# EAGLE schematic EEZ DIB MCU r1B1 (EAGLE 9.1.0)
Assembly variants: Farnell, TME

## Sheet 1 of 5: I/O connectors, encoders, user SW
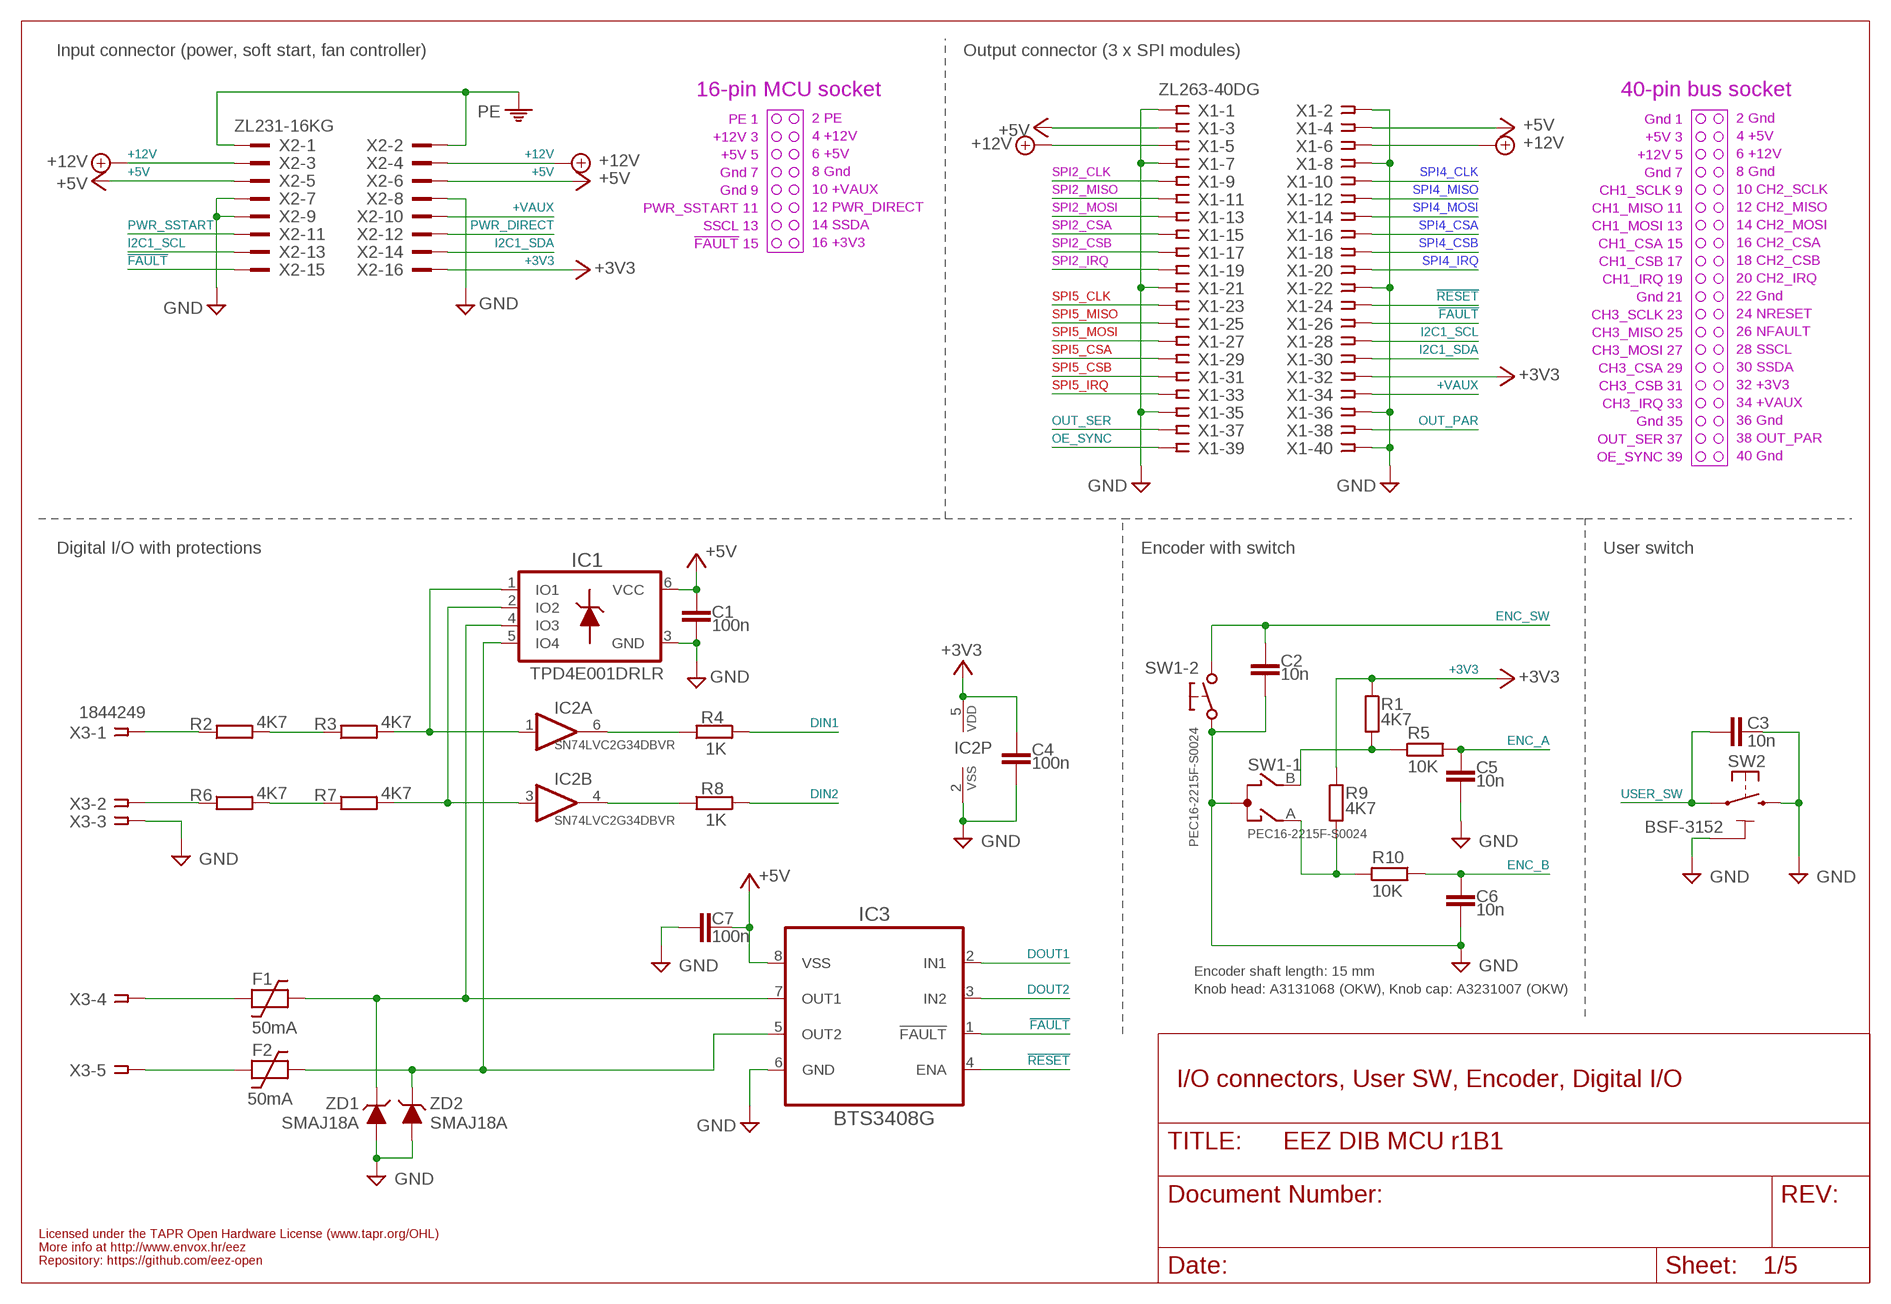
[diagram p0: schematic, sheet 1]

### Parts
C1  100n  C-EUC0603  [C0603]
C2  10n  C-EUC0805  [C0805]
C3  10n  C-EUC0805  [C0805]
C4  100n  C-EUC0603  [C0603]
C5  10n  C-EUC0805  [C0805]
C6  10n  C-EUC0805  [C0805]
C7  100n  C-EUC0603  [C0603]
F1  50mA  FUSE_RESETTABLE21210  [F1210]
F2  50mA  FUSE_RESETTABLE21210  [F1210]
IC1  TPD4E001DRLR  TPD4E001-DRL  [DRL6]
IC2  SN74LVC2G34DBVR  [DBV6]
IC3  BTS3408G  [SOIC127P600X173-8N]
R1  4K7  R-EU_R0805  [R0805]
R2  4K7  R-EU_R0805  [R0805]
R3  4K7  R-EU_R0805  [R0805]
R4  1K  R-EU_R0805  [R0805]
R5  10K  R-EU_R0805  [R0805]
R6  4K7  R-EU_R0805  [R0805]
R7  4K7  R-EU_R0805  [R0805]
R8  1K  R-EU_R0805  [R0805]
R9  4K7  R-EU_R0805  [R0805]
R10  10K  R-EU_R0805  [R0805]
SW1  PEC16-2215F-S0024  ENCODER_SW-PEC16  [PEC16-2215F]
SW2  BSF-3152  BSF-315X  [BSF-315X]
X1  ZL263-40DG  [ZL263-40DG]
X2  ZL231-16KG  IDC-16PIN-ANGLED  [ML16L]
X3  1844249  MC1,5/5-G-3,5  [MC1,5/5-G-3,5]
ZD1  SMAJ18A  PSMAXX  [DO214AC]
ZD2  SMAJ18A  PSMAXX  [DO214AC]

### Nets
!FAULT: IC3.1(!FAULT) X1.26 X2.15 ; also sheet 2
!RESET: IC3.4(ENA) X1.24 ; also sheet 2,3,4,5
+3V3: C4.1 IC2.5(P:VDD) R1.1 R9.1 X1.32 X2.16 ; also sheet 2,3,4,5
+5V: C1.1 C7.2 IC1.6(VCC) IC3.8(VSS) X1.3 X1.4 X2.5 X2.6 ; also sheet 2,4
+12V: X1.5 X1.6 X2.3 X2.4
+VAUX: X1.34 X2.10
DIN1: R4.2 ; also sheet 2
DIN2: R8.2 ; also sheet 2
DOUT1: IC3.2(IN1) ; also sheet 2
DOUT2: IC3.3(IN2) ; also sheet 2
ENC_A: C5.2 R5.1 ; also sheet 2
ENC_B: C6.1 R10.1 ; also sheet 2
ENC_SW: C2.2 SW1.E ; also sheet 2
EOUT_A: R9.2 R10.2 SW1.A(-1:A)
EOUT_B: R1.2 R5.2 SW1.B(-1:B)
GND [gnd]: C1.2 C2.1 C3.1 C4.2 C5.1 C6.2 C7.1 IC1.3(GND) IC2.2(P:VSS) IC3.6(GND) SW1.C(-1:C) SW1.D SW1.GND1(-1:C) SW1.GND2(-1:C) SW2.2 SW2.3(GND) SW2.4(GND) X1.1 X1.2 X1.7 X1.8 X1.21 X1.22 X1.35 X1.36 X1.40 X2.7 X2.8 X2.9 X3.3 ZD1.A ZD2.A ; also sheet 2,3,4,5
I2C1_SCL: X1.28 X2.13 ; also sheet 2,3,4
I2C1_SDA: X1.30 X2.14 ; also sheet 2,3,4
N$38: R2.2 R3.1
N$39: R2.1 X3.1
N$40: R6.1 X3.2
N$41: R6.2 R7.1
N$42: IC2.6(A:O) R4.1
N$43: IC2.4(B:O) R8.1
N$44: F1.1 X3.4
N$45: F2.1 X3.5
N$46: IC1.1(IO1) IC2.1(A:I) R3.2
N$47: IC1.2(IO2) IC2.3(B:I) R7.2
N$48: F1.2 IC1.4(IO3) IC3.7(OUT1) ZD1.C
N$49: F2.2 IC1.5(IO4) IC3.5(OUT2) ZD2.C
OE_SYNC: X1.39 ; also sheet 2
OUT_PAR: X1.38 ; also sheet 2
OUT_SER: X1.37 ; also sheet 2
PE: X2.1 X2.2 ; also sheet 4,5
PWR_DIRECT: X2.12 ; also sheet 2
PWR_SSTART: X2.11 ; also sheet 2
SPI2_CLK: X1.9 ; also sheet 2
SPI2_CSA: X1.15 ; also sheet 2
SPI2_CSB: X1.17 ; also sheet 2
SPI2_IRQ: X1.19 ; also sheet 2
SPI2_MISO: X1.11 ; also sheet 2
SPI2_MOSI: X1.13 ; also sheet 2
SPI4_CLK: X1.10 ; also sheet 2
SPI4_CSA: X1.16 ; also sheet 2
SPI4_CSB: X1.18 ; also sheet 2
SPI4_IRQ: X1.20 ; also sheet 2
SPI4_MISO: X1.12 ; also sheet 2
SPI4_MOSI: X1.14 ; also sheet 2
SPI5_CLK: X1.23 ; also sheet 2
SPI5_CSA: X1.29 ; also sheet 2
SPI5_CSB: X1.31 ; also sheet 2
SPI5_IRQ: X1.33 ; also sheet 2,5
SPI5_MISO: X1.25 ; also sheet 2
SPI5_MOSI: X1.27 ; also sheet 2
USER_SW: C3.2 SW2.1 ; also sheet 2

### Notes on the sheet
- Input connector (power, soft start, fan controller) | Output connector (3 x SPI modules)
- 16-pin MCU socket | 40-pin bus socket
- PE 1 | Gnd 1
- 2 PE | 2 Gnd
- +12V 3 | +5V 3
- 4 +12V | 4 +5V
- +5V 5 | +12V 5
- 6 +5V | 6 +12V
- Gnd 7 | Gnd 7
- 8 Gnd | 8 Gnd
- Gnd 9 | CH1_SCLK 9
- 10 +VAUX | 10 CH2_SCLK
- PWR_SSTART 11 | CH1_MISO 11
- 12 PWR_DIRECT | 12 CH2_MISO
- SSCL 13 | CH1_MOSI 13
- 14 SSDA | 14 CH2_MOSI
- !FAULT! 15 | CH1_CSA 15
- 16 +3V3 | 16 CH2_CSA
- CH1_CSB 17
- 18 CH2_CSB
- CH1_IRQ 19
- 20 CH2_IRQ
- Gnd 21
- 22 Gnd
- CH3_SCLK 23
- 24 NRESET
- CH3_MISO 25
- 26 NFAULT
- CH3_MOSI 27
- 28 SSCL
- CH3_CSA 29
- 30 SSDA
- CH3_CSB 31
- 32 +3V3
- CH3_IRQ 33
- 34 +VAUX
- Gnd 35
- 36 Gnd
- OUT_SER 37
- 38 OUT_PAR
- OE_SYNC 39
- 40 Gnd
- Digital I/O with protections | Encoder with switch | User switch
- Encoder shaft length: 15 mm
- Knob head: A3131068 (OKW), Knob cap: A3231007 (OKW)
- I/O connectors, User SW, Encoder, Digital I/O
- Licensed under the TAPR Open Hardware License (www.tapr.org/OHL)
- More info at http://www.envox.hr/eez
- Repository: https://github.com/eez-open

## Sheet 2 of 5: STM32F7 MCU
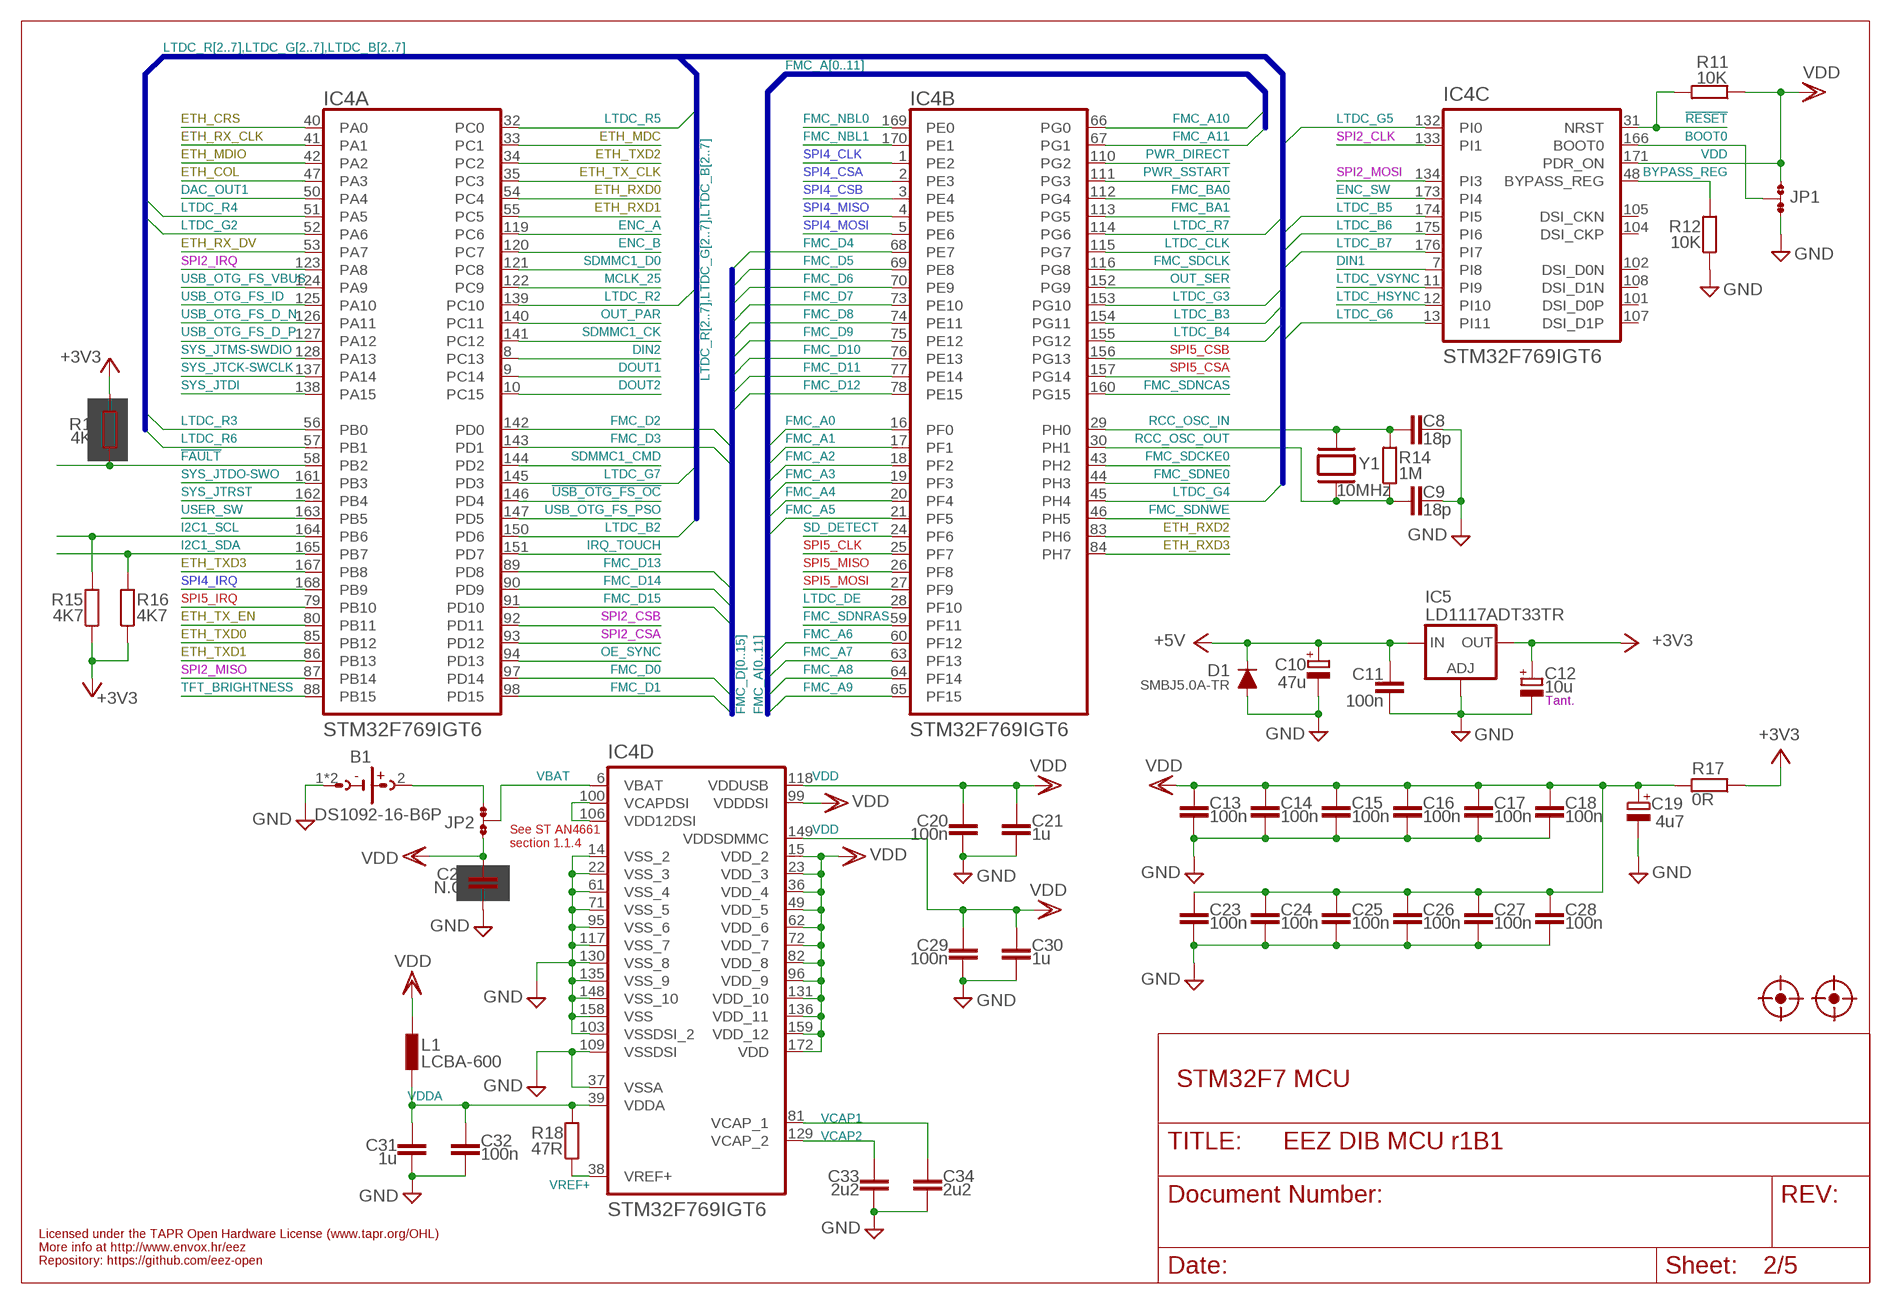
[diagram p1: schematic, sheet 2]

### Parts
B1  DS1092-16-B6P  CELL_BATTERY-THT20MM  [DS1092-16-B6P]
C8  18p  C-EUC0603  [C0603]
C9  18p  C-EUC0603  [C0603]
C10  47u  ECAPPANASONIC_H  [CAPAE660X610N]
C11  100n  C-EUC0603  [C0603]
C12  10u  ECAP1206  [EC1206]
C13  100n  C-EUC0603  [C0603]
C14  100n  C-EUC0603  [C0603]
C15  100n  C-EUC0603  [C0603]
C16  100n  C-EUC0603  [C0603]
C17  100n  C-EUC0603  [C0603]
C18  100n  C-EUC0603  [C0603]
C19  4u7  ECAP1206  [EC1206]
C20  100n  C-EUC0603  [C0603]
C21  1u  C-EUC0805  [C0805]
C22  N.C.  C-EUC0603  [C0603]
C23  100n  C-EUC0603  [C0603]
C24  100n  C-EUC0603  [C0603]
C25  100n  C-EUC0603  [C0603]
C26  100n  C-EUC0603  [C0603]
C27  100n  C-EUC0603  [C0603]
C28  100n  C-EUC0603  [C0603]
C29  100n  C-EUC0603  [C0603]
C30  1u  C-EUC0805  [C0805]
C31  1u  C-EUC0805  [C0805]
C32  100n  C-EUC0603  [C0603]
C33  2u2  C-EUC0805  [C0805]
C34  2u2  C-EUC0805  [C0805]
D1  SMBJ5.0A-TR  DIODEDO214AA  [DO214AA]
FM1  FIDUCIAL  [FIDUCIAL]
FM2  FIDUCIAL  [FIDUCIAL]
IC4  STM32F769IGT6  STM32F769IXT  [LQFP-176_24X24MM]
IC5  LD1117ADT33TR  LD117ADT33TR  [DPACK]
JP1  JP3-CUT  [JP3-CUT]
JP2  JP3-CUT  [JP3-CUT]
L1  LCBA-600  FERRITE_BEAD0603  [BEAD0603]
R11  10K  R-EU_R0805  [R0805]
R12  10K  R-EU_R0805  [R0805]
R13  4K7  R-EU_R0805  [R0805]
R14  1M  R-EU_R0805  [R0805]
R15  4K7  R-EU_R0805  [R0805]
R16  4K7  R-EU_R0805  [R0805]
R17  0R  R-EU_R0805  [R0805]
R18  47R  R-EU_R0805  [R0805]
Y1  10MHz  XTALSMD  [HC-49/4H]

### Nets
!FAULT: IC4.58(A:PB2) R13.2 ; also sheet 1
!RESET: IC4.31(C:NRST) R11.2 ; also sheet 1,3,4,5
!USB_OTG_FS_OC: IC4.146(A:PD4) ; also sheet 4
+3V3: C12.+ IC5.4(OUT) R13.1 R15.1 R16.1 R17.1 ; also sheet 1,3,4,5
+5V: C10.1(+) C11.1 D1.C IC5.3(IN) ; also sheet 1,4
BOOT0: IC4.166(C:BOOT0) JP1.COM
BYPASS_REG: IC4.48(C:BYPASS_REG) R12.2
DAC_OUT1: IC4.50(A:PA4) ; also sheet 4
DIN1: IC4.7(C:PI8) ; also sheet 1
DIN2: IC4.8(A:PC13) ; also sheet 1
DOUT1: IC4.9(A:PC14) ; also sheet 1
DOUT2: IC4.10(A:PC15) ; also sheet 1
ENC_A: IC4.119(A:PC6) ; also sheet 1
ENC_B: IC4.120(A:PC7) ; also sheet 1
ENC_SW: IC4.173(C:PI4) ; also sheet 1
ETH_COL: IC4.47(A:PA3) ; also sheet 5
ETH_CRS: IC4.40(A:PA0) ; also sheet 5
ETH_MDC: IC4.33(A:PC1) ; also sheet 5
ETH_MDIO: IC4.42(A:PA2) ; also sheet 5
ETH_RX_CLK: IC4.41(A:PA1) ; also sheet 5
ETH_RX_DV: IC4.53(A:PA7) ; also sheet 5
ETH_RXD0: IC4.54(A:PC4) ; also sheet 5
ETH_RXD1: IC4.55(A:PC5) ; also sheet 5
ETH_RXD2: IC4.83(B:PH6) ; also sheet 5
ETH_RXD3: IC4.84(B:PH7) ; also sheet 5
ETH_TX_CLK: IC4.35(A:PC3) ; also sheet 5
ETH_TX_EN: IC4.80(A:PB11) ; also sheet 5
ETH_TXD0: IC4.85(A:PB12) ; also sheet 5
ETH_TXD1: IC4.86(A:PB13) ; also sheet 5
ETH_TXD2: IC4.34(A:PC2) ; also sheet 5
ETH_TXD3: IC4.167(A:PB8) ; also sheet 5
FMC_A0: IC4.16(B:PF0) ; also sheet 3
FMC_A1: IC4.17(B:PF1) ; also sheet 3
FMC_A2: IC4.18(B:PF2) ; also sheet 3
FMC_A3: IC4.19(B:PF3) ; also sheet 3
FMC_A4: IC4.20(B:PF4) ; also sheet 3
FMC_A5: IC4.21(B:PF5) ; also sheet 3
FMC_A6: IC4.60(B:PF12) ; also sheet 3
FMC_A7: IC4.63(B:PF13) ; also sheet 3
FMC_A8: IC4.64(B:PF14) ; also sheet 3
FMC_A9: IC4.65(B:PF15) ; also sheet 3
FMC_A10: IC4.66(B:PG0) ; also sheet 3
FMC_A11: IC4.67(B:PG1) ; also sheet 3
FMC_BA0: IC4.112(B:PG4) ; also sheet 3
FMC_BA1: IC4.113(B:PG5) ; also sheet 3
FMC_D0: IC4.97(A:PD14) ; also sheet 3
FMC_D1: IC4.98(A:PD15) ; also sheet 3
FMC_D2: IC4.142(A:PD0) ; also sheet 3
FMC_D3: IC4.143(A:PD1) ; also sheet 3
FMC_D4: IC4.68(B:PE7) ; also sheet 3
FMC_D5: IC4.69(B:PE8) ; also sheet 3
FMC_D6: IC4.70(B:PE9) ; also sheet 3
FMC_D7: IC4.73(B:PE10) ; also sheet 3
FMC_D8: IC4.74(B:PE11) ; also sheet 3
FMC_D9: IC4.75(B:PE12) ; also sheet 3
FMC_D10: IC4.76(B:PE13) ; also sheet 3
FMC_D11: IC4.77(B:PE14) ; also sheet 3
FMC_D12: IC4.78(B:PE15) ; also sheet 3
FMC_D13: IC4.89(A:PD8) ; also sheet 3
FMC_D14: IC4.90(A:PD9) ; also sheet 3
FMC_D15: IC4.91(A:PD10) ; also sheet 3
FMC_NBL0: IC4.169(B:PE0) ; also sheet 3
FMC_NBL1: IC4.170(B:PE1) ; also sheet 3
FMC_SDCKE0: IC4.43(B:PH2) ; also sheet 3
FMC_SDCLK: IC4.116(B:PG8) ; also sheet 3
FMC_SDNCAS: IC4.160(B:PG15) ; also sheet 3
FMC_SDNE0: IC4.44(B:PH3) ; also sheet 3
FMC_SDNRAS: IC4.59(B:PF11) ; also sheet 3
FMC_SDNWE: IC4.46(B:PH5) ; also sheet 3
GND [gnd]: B1.1(-) B1.3(-) C8.1 C9.1 C10.2(-) C11.2 C12.- C13.2 C14.2 C15.2 C16.2 C17.2 C18.2 C19.- C20.2 C21.2 C22.2 C23.2 C24.2 C25.2 C26.2 C27.2 C28.2 C29.2 C30.2 C31.2 C32.2 C33.2 C34.2 D1.A IC4.14(D:VSS_2) IC4.22(D:VSS_3) IC4.37(D:VSSA) IC4.61(D:VSS_4) IC4.71(D:VSS_5) IC4.95(D:VSS_6) IC4.103(D:VSSDSI_2) IC4.109(D:VSSDSI) IC4.117(D:VSS_7) IC4.130(D:VSS_8) IC4.135(D:VSS_9) IC4.148(D:VSS_10) IC4.158(D:VSS) IC5.1(ADJ) JP1.NC R12.1 ; also sheet 1,3,4,5
I2C1_SCL: IC4.164(A:PB6) R15.2 ; also sheet 1,3,4
I2C1_SDA: IC4.165(A:PB7) R16.2 ; also sheet 1,3,4
IRQ_TOUCH: IC4.151(A:PD7) ; also sheet 4
LTDC_B2: IC4.150(A:PD6) ; also sheet 4
LTDC_B3: IC4.154(B:PG11) ; also sheet 4
LTDC_B4: IC4.155(B:PG12) ; also sheet 4
LTDC_B5: IC4.174(C:PI5) ; also sheet 4
LTDC_B6: IC4.175(C:PI6) ; also sheet 4
LTDC_B7: IC4.176(C:PI7) ; also sheet 4
LTDC_CLK: IC4.115(B:PG7) ; also sheet 4
LTDC_DE: IC4.28(B:PF10) ; also sheet 4
LTDC_G2: IC4.52(A:PA6) ; also sheet 4
LTDC_G3: IC4.153(B:PG10) ; also sheet 4
LTDC_G4: IC4.45(B:PH4) ; also sheet 4
LTDC_G5: IC4.132(C:PI0) ; also sheet 4
LTDC_G6: IC4.13(C:PI11) ; also sheet 4
LTDC_G7: IC4.145(A:PD3) ; also sheet 4
LTDC_HSYNC: IC4.12(C:PI10) ; also sheet 4
LTDC_R2: IC4.139(A:PC10) ; also sheet 4
LTDC_R3: IC4.56(A:PB0) ; also sheet 4
LTDC_R4: IC4.51(A:PA5) ; also sheet 4
LTDC_R5: IC4.32(A:PC0) ; also sheet 4
LTDC_R6: IC4.57(A:PB1) ; also sheet 4
LTDC_R7: IC4.114(B:PG6) ; also sheet 4
LTDC_VSYNC: IC4.11(C:PI9) ; also sheet 4
MCLK_25: IC4.122(A:PC9) ; also sheet 5
N$20: B1.2(+) JP2.NC
N$178: IC4.100(D:VCAPDSI) IC4.106(D:VDD12DSI)
OE_SYNC: IC4.94(A:PD13) ; also sheet 1
OUT_PAR: IC4.140(A:PC11) ; also sheet 1
OUT_SER: IC4.152(B:PG9) ; also sheet 1
PWR_DIRECT: IC4.110(B:PG2) ; also sheet 1
PWR_SSTART: IC4.111(B:PG3) ; also sheet 1
RCC_OSC_IN: C8.2 IC4.29(B:PH0) R14.2 Y1.2
RCC_OSC_OUT: C9.2 IC4.30(B:PH1) R14.1 Y1.1
SD_DETECT: IC4.24(B:PF6) ; also sheet 3
SDMMC1_CK: IC4.141(A:PC12) ; also sheet 3
SDMMC1_CMD: IC4.144(A:PD2) ; also sheet 3
SDMMC1_D0: IC4.121(A:PC8) ; also sheet 3
SPI2_CLK: IC4.133(C:PI1) ; also sheet 1
SPI2_CSA: IC4.93(A:PD12) ; also sheet 1
SPI2_CSB: IC4.92(A:PD11) ; also sheet 1
SPI2_IRQ: IC4.123(A:PA8) ; also sheet 1
SPI2_MISO: IC4.87(A:PB14) ; also sheet 1
SPI2_MOSI: IC4.134(C:PI3) ; also sheet 1
SPI4_CLK: IC4.1(B:PE2) ; also sheet 1
SPI4_CSA: IC4.2(B:PE3) ; also sheet 1
SPI4_CSB: IC4.3(B:PE4) ; also sheet 1
SPI4_IRQ: IC4.168(A:PB9) ; also sheet 1
SPI4_MISO: IC4.4(B:PE5) ; also sheet 1
SPI4_MOSI: IC4.5(B:PE6) ; also sheet 1
SPI5_CLK: IC4.25(B:PF7) ; also sheet 1
SPI5_CSA: IC4.157(B:PG14) ; also sheet 1
SPI5_CSB: IC4.156(B:PG13) ; also sheet 1
SPI5_IRQ: IC4.79(A:PB10) ; also sheet 1,5
SPI5_MISO: IC4.26(B:PF8) ; also sheet 1
SPI5_MOSI: IC4.27(B:PF9) ; also sheet 1
SYS_JTCK-SWCLK: IC4.137(A:PA14) ; also sheet 3
SYS_JTDI: IC4.138(A:PA15) ; also sheet 3
SYS_JTDO-SWO: IC4.161(A:PB3) ; also sheet 3
SYS_JTMS-SWDIO: IC4.128(A:PA13) ; also sheet 3
SYS_JTRST: IC4.162(A:PB4) ; also sheet 3
TFT_BRIGHTNESS: IC4.88(A:PB15) ; also sheet 4
USB_OTG_FS_D_N [diff]: IC4.126(A:PA11) ; also sheet 4
USB_OTG_FS_D_P [diff]: IC4.127(A:PA12) ; also sheet 4
USB_OTG_FS_ID: IC4.125(A:PA10) ; also sheet 4
USB_OTG_FS_PSO: IC4.147(A:PD5) ; also sheet 4
USB_OTG_FS_VBUS: IC4.124(A:PA9) ; also sheet 4
USER_SW: IC4.163(A:PB5) ; also sheet 1
VBAT: IC4.6(D:VBAT) JP2.COM
VCAP1: C34.1 IC4.81(D:VCAP_1)
VCAP2: C33.1 IC4.129(D:VCAP_2)
VDD: C13.1 C14.1 C15.1 C16.1 C17.1 C18.1 C19.+ C20.1 C21.1 C22.1 C23.1 C24.1 C25.1 C26.1 C27.1 C28.1 C29.1 C30.1 IC4.15(D:VDD_2) IC4.23(D:VDD_3) IC4.36(D:VDD_4) IC4.49(D:VDD_5) IC4.62(D:VDD_6) IC4.72(D:VDD_7) IC4.82(D:VDD_8) IC4.96(D:VDD_9) IC4.99(D:VDDDSI) IC4.118(D:VDDUSB) IC4.131(D:VDD_10) IC4.136(D:VDD_11) IC4.149(D:VDDSDMMC) IC4.159(D:VDD_12) IC4.171(C:PDR_ON) IC4.172(D:VDD) JP1.NO JP2.NO L1.P$1 R11.1 R17.2
VDDA: C31.1 C32.1 IC4.39(D:VDDA) L1.P$2 R18.2
VREF+: IC4.38(D:VREF+) R18.1
Unconnected: IC4.101(C:DSI_D0P) IC4.102(C:DSI_D0N) IC4.104(C:DSI_CKP) IC4.105(C:DSI_CKN) IC4.107(C:DSI_D1P) IC4.108(C:DSI_D1N)

### Buses
FMC_A[0..11]
LTDC_R[2..7],LTDC_G[2..7],LTDC_B[2..7]
FMC_D[0..15]

### Notes on the sheet
- Tant.
- See ST AN4661
  section 1.1.4
- STM32F7 MCU
- Licensed under the TAPR Open Hardware License (www.tapr.org/OHL)
- More info at http://www.envox.hr/eez
- Repository: https://github.com/eez-open

## Sheet 3 of 5: SDRAM, JTAG, SD card, EEPROM
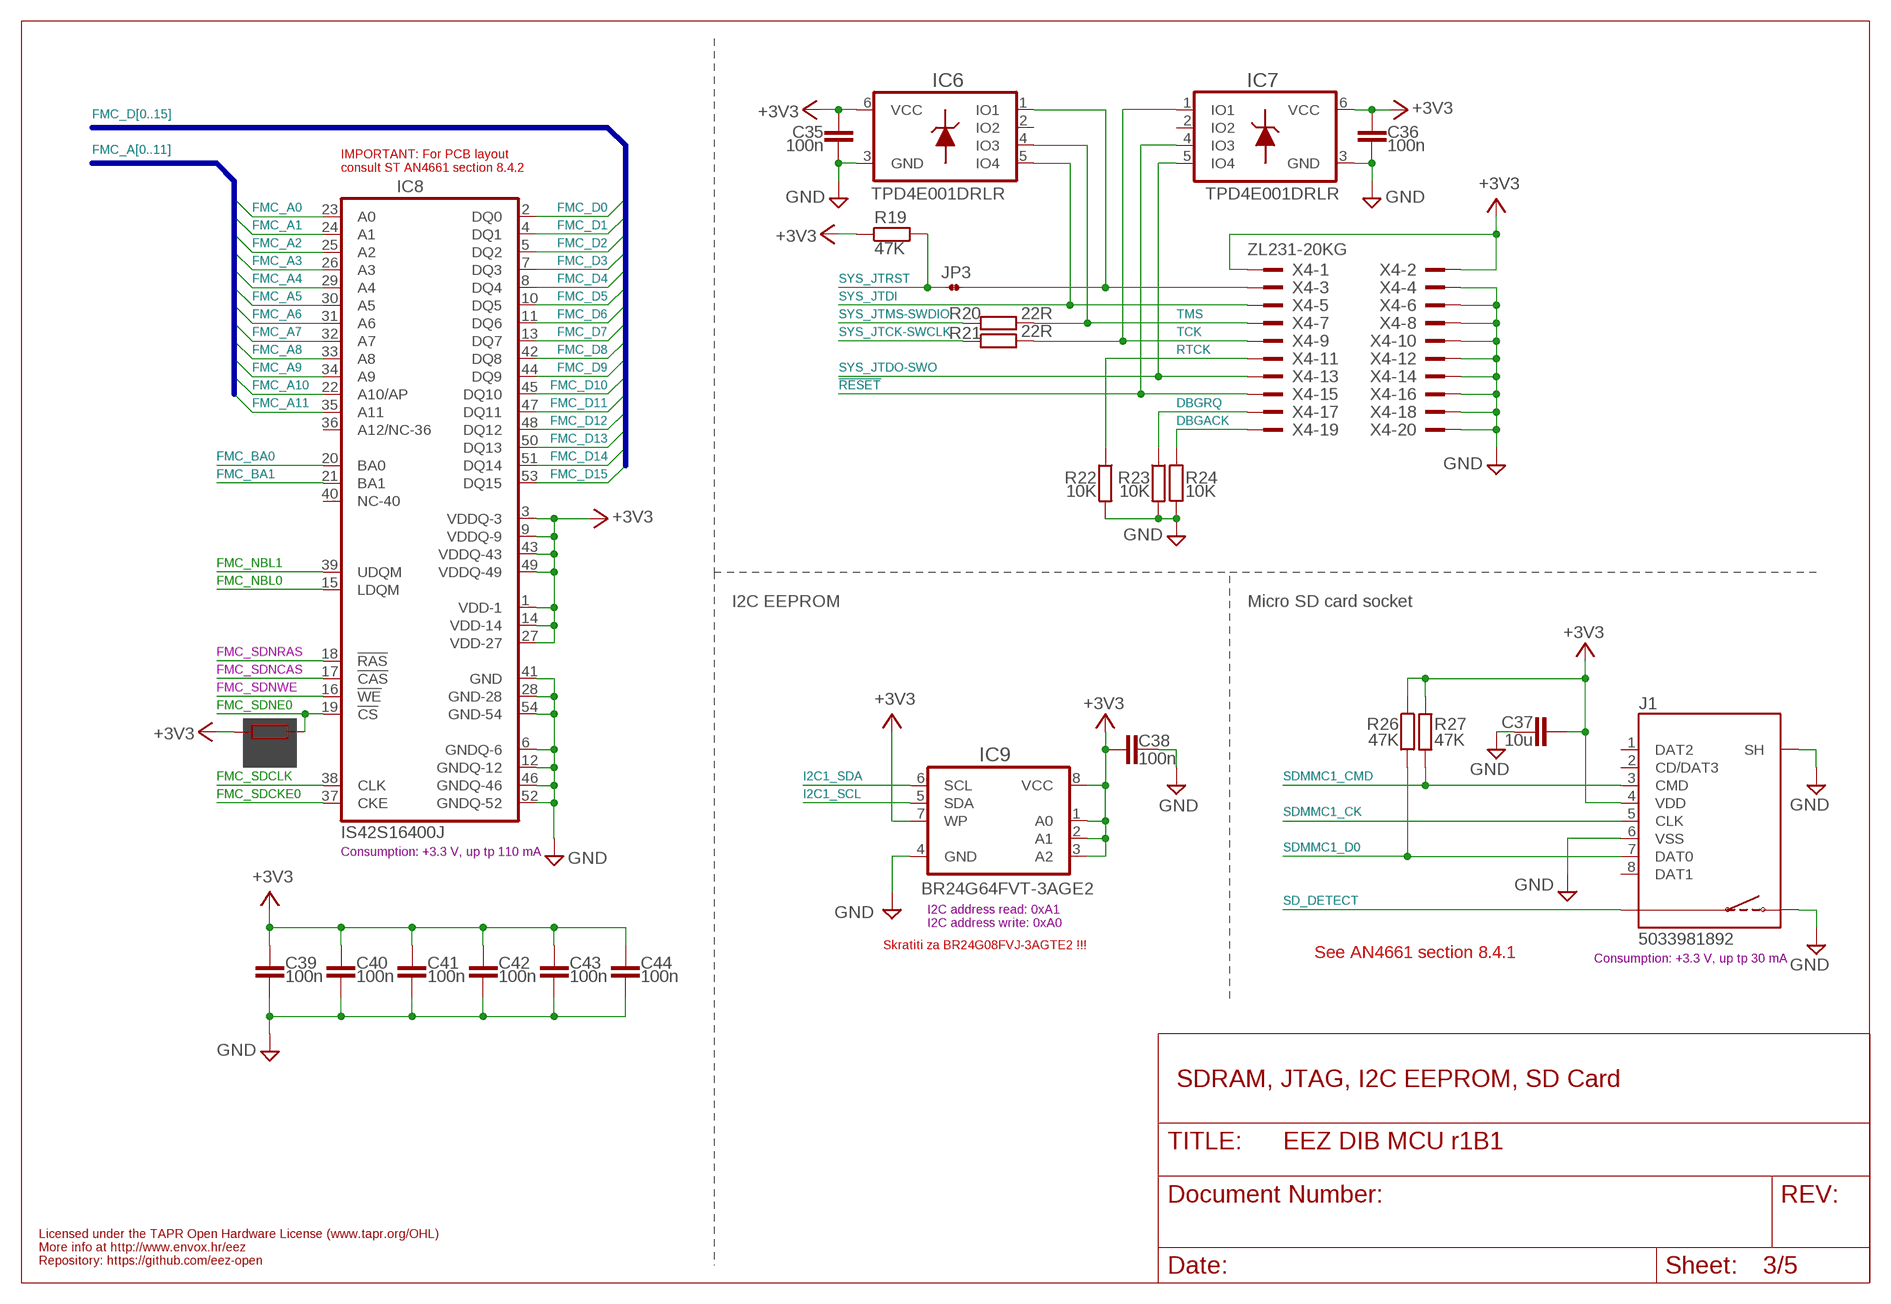
[diagram p2: schematic, sheet 3]

### Parts
C35  100n  C-EUC0603  [C0603]
C36  100n  C-EUC0603  [C0603]
C37  10u  C-EUC1210  [C1210]
C38  100n  C-EUC0603  [C0603]
C39  100n  C-EUC0603  [C0603]
C40  100n  C-EUC0603  [C0603]
C41  100n  C-EUC0603  [C0603]
C42  100n  C-EUC0603  [C0603]
C43  100n  C-EUC0603  [C0603]
C44  100n  C-EUC0603  [C0603]
IC6  TPD4E001DRLR  TPD4E001-DRL  [DRL6]
IC7  TPD4E001DRLR  TPD4E001-DRL  [DRL6]
IC8  IS42S16400J  IS42S16400  [TSOPII-54]
IC9  BR24G64FVT-3AGE2  BR24GXXX-TSSOP  [PW8_TSSOP8]
J1  5033981892  [5033981892]
JP3  JP2-NOCUT  [JP2-NOCUT]
R19  47K  R-EU_R0805  [R0805]
R20  22R  R-EU_R0805  [R0805]
R21  22R  R-EU_R0805  [R0805]
R22  10K  R-EU_R0805  [R0805]
R23  10K  R-EU_R0805  [R0805]
R24  10K  R-EU_R0805  [R0805]
R25  10K  R-EU_R0805  [R0805]
R26  47K  R-EU_R0805  [R0805]
R27  47K  R-EU_R0805  [R0805]
X4  ZL231-20KG  IDC-20PIN-ANGLED  [ML20L]

### Nets
!RESET: IC7.4(IO3) X4.15 ; also sheet 1,2,4,5
+3V3: C35.1 C36.1 C37.1 C38.2 C39.1 C40.1 C41.1 C42.1 C43.1 C44.1 IC6.6(VCC) IC7.6(VCC) IC8.1(VDD-1) IC8.3(VDDQ-3) IC8.9(VDDQ-9) IC8.14(VDD-14) IC8.27(VDD-27) IC8.43(VDDQ-43) IC8.49(VDDQ-49) IC9.1(A0) IC9.2(A1) IC9.3(A2) IC9.7(WP) IC9.8(VCC) J1.4(VDD) R19.1 R25.1 R26.1 R27.1 X4.1 X4.2 ; also sheet 1,2,4,5
DBGACK: R24.1 X4.19
DBGRQ: R23.1 X4.17
FMC_A0: IC8.23(A0) ; also sheet 2
FMC_A1: IC8.24(A1) ; also sheet 2
FMC_A2: IC8.25(A2) ; also sheet 2
FMC_A3: IC8.26(A3) ; also sheet 2
FMC_A4: IC8.29(A4) ; also sheet 2
FMC_A5: IC8.30(A5) ; also sheet 2
FMC_A6: IC8.31(A6) ; also sheet 2
FMC_A7: IC8.32(A7) ; also sheet 2
FMC_A8: IC8.33(A8) ; also sheet 2
FMC_A9: IC8.34(A9) ; also sheet 2
FMC_A10: IC8.22(A10/AP) ; also sheet 2
FMC_A11: IC8.35(A11) ; also sheet 2
FMC_BA0: IC8.20(BA0) ; also sheet 2
FMC_BA1: IC8.21(BA1) ; also sheet 2
FMC_D0: IC8.2(DQ0) ; also sheet 2
FMC_D1: IC8.4(DQ1) ; also sheet 2
FMC_D2: IC8.5(DQ2) ; also sheet 2
FMC_D3: IC8.7(DQ3) ; also sheet 2
FMC_D4: IC8.8(DQ4) ; also sheet 2
FMC_D5: IC8.10(DQ5) ; also sheet 2
FMC_D6: IC8.11(DQ6) ; also sheet 2
FMC_D7: IC8.13(DQ7) ; also sheet 2
FMC_D8: IC8.42(DQ8) ; also sheet 2
FMC_D9: IC8.44(DQ9) ; also sheet 2
FMC_D10: IC8.45(DQ10) ; also sheet 2
FMC_D11: IC8.47(DQ11) ; also sheet 2
FMC_D12: IC8.48(DQ12) ; also sheet 2
FMC_D13: IC8.50(DQ13) ; also sheet 2
FMC_D14: IC8.51(DQ14) ; also sheet 2
FMC_D15: IC8.53(DQ15) ; also sheet 2
FMC_NBL0: IC8.15(LDQM) ; also sheet 2
FMC_NBL1: IC8.39(UDQM) ; also sheet 2
FMC_SDCKE0: IC8.37(CKE) ; also sheet 2
FMC_SDCLK: IC8.38(CLK) ; also sheet 2
FMC_SDNCAS: IC8.17(!CAS) ; also sheet 2
FMC_SDNE0: IC8.19(!CS) R25.2 ; also sheet 2
FMC_SDNRAS: IC8.18(!RAS) ; also sheet 2
FMC_SDNWE: IC8.16(!WE) ; also sheet 2
GND [gnd]: C35.2 C36.2 C37.2 C38.1 C39.2 C40.2 C41.2 C42.2 C43.2 C44.2 IC6.3(GND) IC7.3(GND) IC8.6(GNDQ-6) IC8.12(GNDQ-12) IC8.28(GND-28) IC8.41(GND) IC8.46(GNDQ-46) IC8.52(GNDQ-52) IC8.54(GND-54) IC9.4(GND) J1.6(VSS) J1.S(SH) J1.SW2 R22.2 R23.2 R24.2 X4.4 X4.6 X4.8 X4.10 X4.12 X4.14 X4.16 X4.18 X4.20 ; also sheet 1,2,4,5
I2C1_SCL: IC9.5(SDA) ; also sheet 1,2,4
I2C1_SDA: IC9.6(SCL) ; also sheet 1,2,4
RTCK: R22.1 X4.11
SD_DETECT: J1.SW1 ; also sheet 2
SDMMC1_CK: J1.5(CLK) ; also sheet 2
SDMMC1_CMD: J1.3(CMD) R27.2 ; also sheet 2
SDMMC1_D0: J1.7(DAT0) R26.2 ; also sheet 2
SYS_JTCK-SWCLK: R21.1 ; also sheet 2
SYS_JTDI: IC6.5(IO4) X4.5 ; also sheet 2
SYS_JTDO-SWO: IC7.5(IO4) X4.13 ; also sheet 2
SYS_JTMS-SWDIO: R20.1 ; also sheet 2
SYS_JTRST: JP3.1 R19.2 ; also sheet 2
TCK: IC7.1(IO1) R21.2 X4.9
TMS: IC6.4(IO3) R20.2 X4.7
TRST: IC6.1(IO1) JP3.2 X4.3
Unconnected: IC6.2(IO2) IC7.2(IO2) IC8.36(A12/NC-36) IC8.40(NC-40) J1.1(DAT2) J1.2(CD/DAT3) J1.8(DAT1)

### Buses
FMC_A[0..11]
FMC_D[0..15]

### Notes on the sheet
- IMPORTANT: For PCB layout 
  consult ST AN4661 section 8.4.2
- I2C EEPROM | Micro SD card socket
- Consumption: +3.3 V, up tp 110 mA
- I2C address read: 0xA1
- I2C address write: 0xA0
- Skratiti za BR24G08FVJ-3AGTE2 !!!
- See AN4661 section 8.4.1
- Consumption: +3.3 V, up tp 30 mA
- SDRAM, JTAG, I2C EEPROM, SD Card
- Licensed under the TAPR Open Hardware License (www.tapr.org/OHL)
- More info at http://www.envox.hr/eez
- Repository: https://github.com/eez-open

## Sheet 4 of 5: TFT, Audio, USB
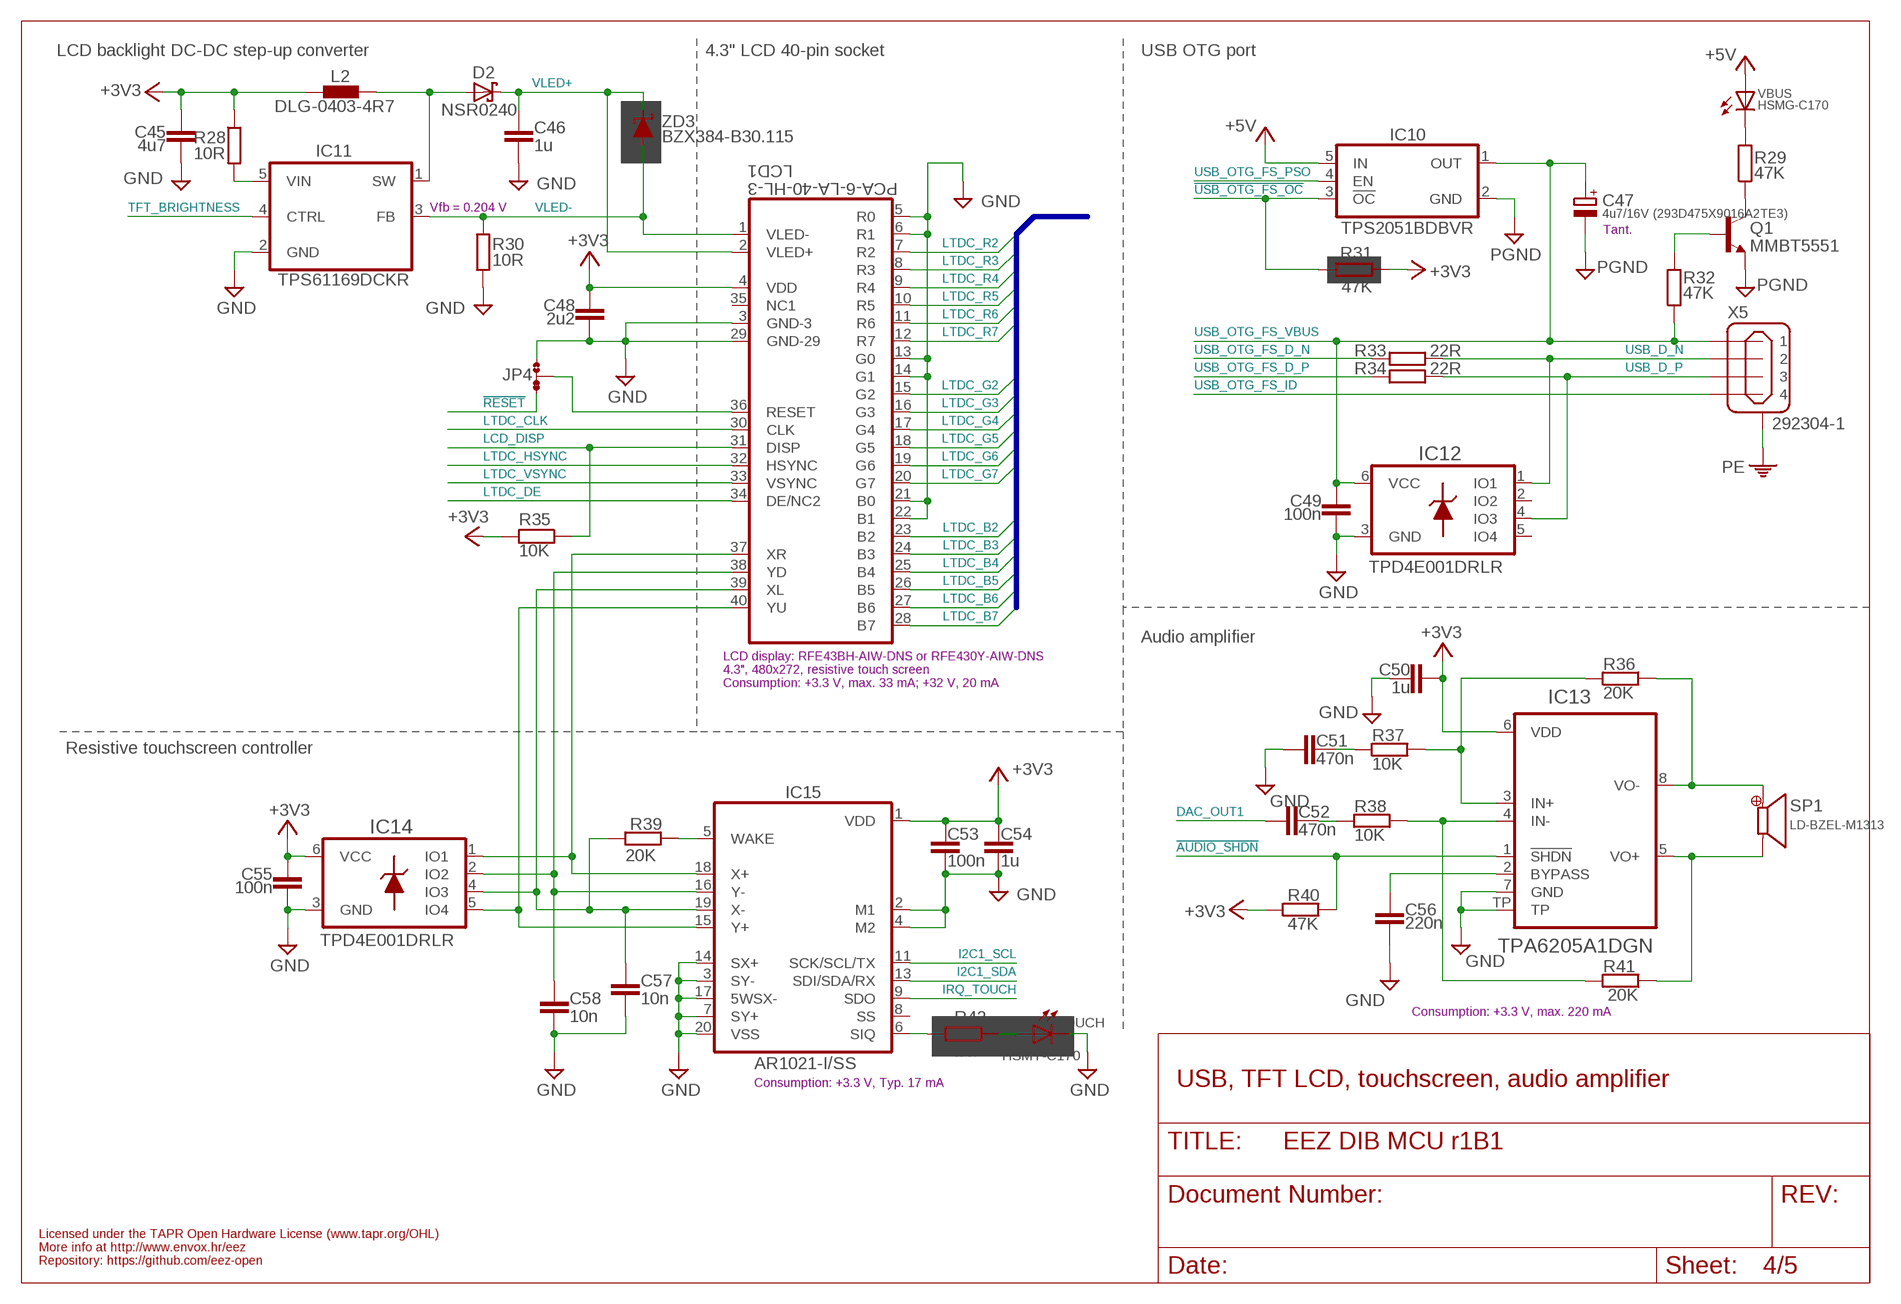
[diagram p3: schematic, sheet 4]

### Parts
C45  4u7  C-EUC1206  [C1206]
C46  1u  C-EUC0805  [C0805]
C47  4u7/16V (293D475X9016A2TE3)  ECAP1206  [EC1206]
C48  2u2  C-EUC0805  [C0805]
C49  100n  C-EUC0603  [C0603]
C50  1u  C-EUC0805  [C0805]
C51  470n  C-EUC0805  [C0805]
C52  470n  C-EUC0805  [C0805]
C53  100n  C-EUC0603  [C0603]
C54  1u  C-EUC0805  [C0805]
C55  100n  C-EUC0603  [C0603]
C56  220n  C-EUC0805  [C0805]
C57  10n  C-EUC0805  [C0805]
C58  10n  C-EUC0805  [C0805]
D2  NSR0240  SCHOTTKYSOD123  [SOD123]
IC10  TPS2051BDBVR  TPS2051B  [DBV5]
IC11  TPS61169DCKR  [DCK5]
IC12  TPD4E001DRLR  TPD4E001-DRL  [DRL6]
IC13  TPA6205A1DGN  TPA6205  [SOP65P490X110-9N]
IC14  TPD4E001DRLR  TPD4E001-DRL  [DRL6]
IC15  AR1021-I/SS  [SOP65P780X200-20N]
JP4  JP3-CUT  [JP3-CUT]
L2  DLG-0403-4R7  DE0403  [DE0403]
LCD1  PCA-6-LA-40-HL-3  RFE430Y-AIW-DNS  [FPC_40]
Q1  MMBT5551  MMBT5551LT1-NPN-SOT23-BEC  [SOT23-BEC]
R28  10R  R-EU_R0805  [R0805]
R29  47K  R-EU_R0805  [R0805]
R30  10R  R-EU_R0805  [R0805]
R31  47K  R-EU_R0805  [R0805]
R32  47K  R-EU_R0805  [R0805]
R33  22R  R-EU_R0805  [R0805]
R34  22R  R-EU_R0805  [R0805]
R35  10K  R-EU_R0805  [R0805]
R36  20K  R-EU_R0805  [R0805]
R37  10K  R-EU_R0805  [R0805]
R38  10K  R-EU_R0805  [R0805]
R39  20K  R-EU_R0805  [R0805]
R40  47K  R-EU_R0805  [R0805]
R41  20K  R-EU_R0805  [R0805]
R42  4K7  R-EU_R0805  [R0805]
SP1  LD-BZEL-M1313  [LD-BZEL-M1313]
TOUCH  HSMY-C170  LED0805  [LED_0805]
VBUS  HSMG-C170  LED0805  [LED_0805]
X5  292304-1  USB-B292304-1  [USB-B]
ZD3  BZX384-B30.115  ZENER-DIODESOD323  [SOD323-W]

### Nets
!AUDIO_SHDN: IC13.1(!SHDN) R40.1
!RESET: JP4.NC ; also sheet 1,2,3,5
!USB_OTG_FS_OC: IC10.3(!OC) R31.1 ; also sheet 2
+3V3: C45.1 C48.1 C50.2 C53.2 C54.2 C55.2 IC13.6(VDD) IC14.6(VCC) IC15.1(VDD) L2.1 LCD1.4(VDD) R28.1 R31.2 R35.2 R40.2 ; also sheet 1,2,3,5
+5V: IC10.5(IN) VBUS.A ; also sheet 1,2
DAC_OUT1: C52.2 ; also sheet 2
GND [gnd]: C45.2 C46.2 C47.- C48.2 C49.1 C50.1 C51.2 C53.1 C54.1 C55.1 C56.1 C57.2 C58.2 IC10.2(GND) IC11.2(GND) IC12.3(GND) IC13.7(GND) IC13.TP IC14.3(GND) IC15.2(M1) IC15.3(SY-) IC15.4(M2) IC15.7(SY+) IC15.14(SX+) IC15.17(5WSX-) IC15.20(VSS) JP4.NO LCD1.3(GND-3) LCD1.5(R0) LCD1.6(R1) LCD1.13(G0) LCD1.14(G1) LCD1.21(B0) LCD1.22(B1) LCD1.29(GND-29) Q1.E R30.2 TOUCH.C ; supply symbol labelled PGND ; also sheet 1,2,3,5
I2C1_SCL: IC15.11(SCK/SCL/TX) ; also sheet 1,2,3
I2C1_SDA: IC15.13(SDI/SDA/RX) ; also sheet 1,2,3
IRQ_TOUCH: IC15.9(SDO) ; also sheet 2
LCD_DISP: LCD1.31(DISP) R35.1
LTDC_B2: LCD1.23(B2) ; also sheet 2
LTDC_B3: LCD1.24(B3) ; also sheet 2
LTDC_B4: LCD1.25(B4) ; also sheet 2
LTDC_B5: LCD1.26(B5) ; also sheet 2
LTDC_B6: LCD1.27(B6) ; also sheet 2
LTDC_B7: LCD1.28(B7) ; also sheet 2
LTDC_CLK: LCD1.30(CLK) ; also sheet 2
LTDC_DE: LCD1.34(DE/NC2) ; also sheet 2
LTDC_G2: LCD1.15(G2) ; also sheet 2
LTDC_G3: LCD1.16(G3) ; also sheet 2
LTDC_G4: LCD1.17(G4) ; also sheet 2
LTDC_G5: LCD1.18(G5) ; also sheet 2
LTDC_G6: LCD1.19(G6) ; also sheet 2
LTDC_G7: LCD1.20(G7) ; also sheet 2
LTDC_HSYNC: LCD1.32(HSYNC) ; also sheet 2
LTDC_R2: LCD1.7(R2) ; also sheet 2
LTDC_R3: LCD1.8(R3) ; also sheet 2
LTDC_R4: LCD1.9(R4) ; also sheet 2
LTDC_R5: LCD1.10(R5) ; also sheet 2
LTDC_R6: LCD1.11(R6) ; also sheet 2
LTDC_R7: LCD1.12(R7) ; also sheet 2
LTDC_VSYNC: LCD1.33(VSYNC) ; also sheet 2
N$2: R29.2 VBUS.C
N$4: C57.1 IC14.4(IO3) IC15.19(X-) LCD1.39(XL) R39.2
N$5: IC14.1(IO1) IC15.18(X+) LCD1.37(XR)
N$6: IC15.5(WAKE) R39.1
N$7: C58.1 IC14.2(IO2) IC15.16(Y-) LCD1.38(YD)
N$13: R42.1 TOUCH.A
N$14: IC15.6(SIQ) R42.2
N$16: Q1.C R29.1
N$19: Q1.B R32.2
N$24: JP4.COM LCD1.36(RESET)
N$30: IC11.5(VIN) R28.2
N$50: IC13.5(VO+) R41.1 SP1.-
N$70: IC14.5(IO4) IC15.15(Y+) LCD1.40(YU)
N$166: IC13.8(VO-) R36.1 SP1.+
N$171: IC13.4(IN-) R38.1 R41.2
N$181: IC13.3(IN+) R36.2 R37.1
N$193: C51.1 R37.2
N$194: C56.2 IC13.2(BYPASS)
N$195: C52.1 R38.2
PE: X5.M1(SHIELD) X5.M2(SHIELD) ; also sheet 1,5
SW_WLED: D2.A IC11.1(SW) L2.2
TFT_BRIGHTNESS: IC11.4(CTRL) ; also sheet 2
USB_D_N [diff]: IC12.1(IO1) R33.1 X5.2
USB_D_P [diff]: IC12.4(IO3) R34.1 X5.3
USB_OTG_FS_D_N [diff]: R33.2 ; also sheet 2
USB_OTG_FS_D_P [diff]: R34.2 ; also sheet 2
USB_OTG_FS_ID: X5.4 ; also sheet 2
USB_OTG_FS_PSO: IC10.4(EN) ; also sheet 2
USB_OTG_FS_VBUS: C47.+ C49.2 IC10.1(OUT) IC12.6(VCC) R32.1 X5.1 ; also sheet 2
VLED+: C46.1 D2.C LCD1.2(VLED+) ZD3.C
VLED-: IC11.3(FB) LCD1.1(VLED-) R30.1 ZD3.A
Unconnected: IC12.2(IO2) IC12.5(IO4) IC15.8(SS) LCD1.35(NC1)

### Buses
LTDC_R[2..7],LTDC_G[2..7],LTDC_B[2..7]

### Notes on the sheet
- LCD backlight DC-DC step-up converter | 4.3" LCD 40-pin socket | USB OTG port
- Vfb = 0.204 V
- Tant.
- Audio amplifier
- LCD display: RFE43BH-AIW-DNS or RFE430Y-AIW-DNS
- 4.3", 480x272, resistive touch screen
- Consumption: +3.3 V, max. 33 mA; +32 V, 20 mA
- Resistive touchscreen controller
- Consumption: +3.3 V, max. 220 mA
- Consumption: +3.3 V, Typ. 17 mA | USB, TFT LCD, touchscreen, audio amplifier
- Licensed under the TAPR Open Hardware License (www.tapr.org/OHL)
- More info at http://www.envox.hr/eez
- Repository: https://github.com/eez-open

## Sheet 5 of 5: Ethernet PHY
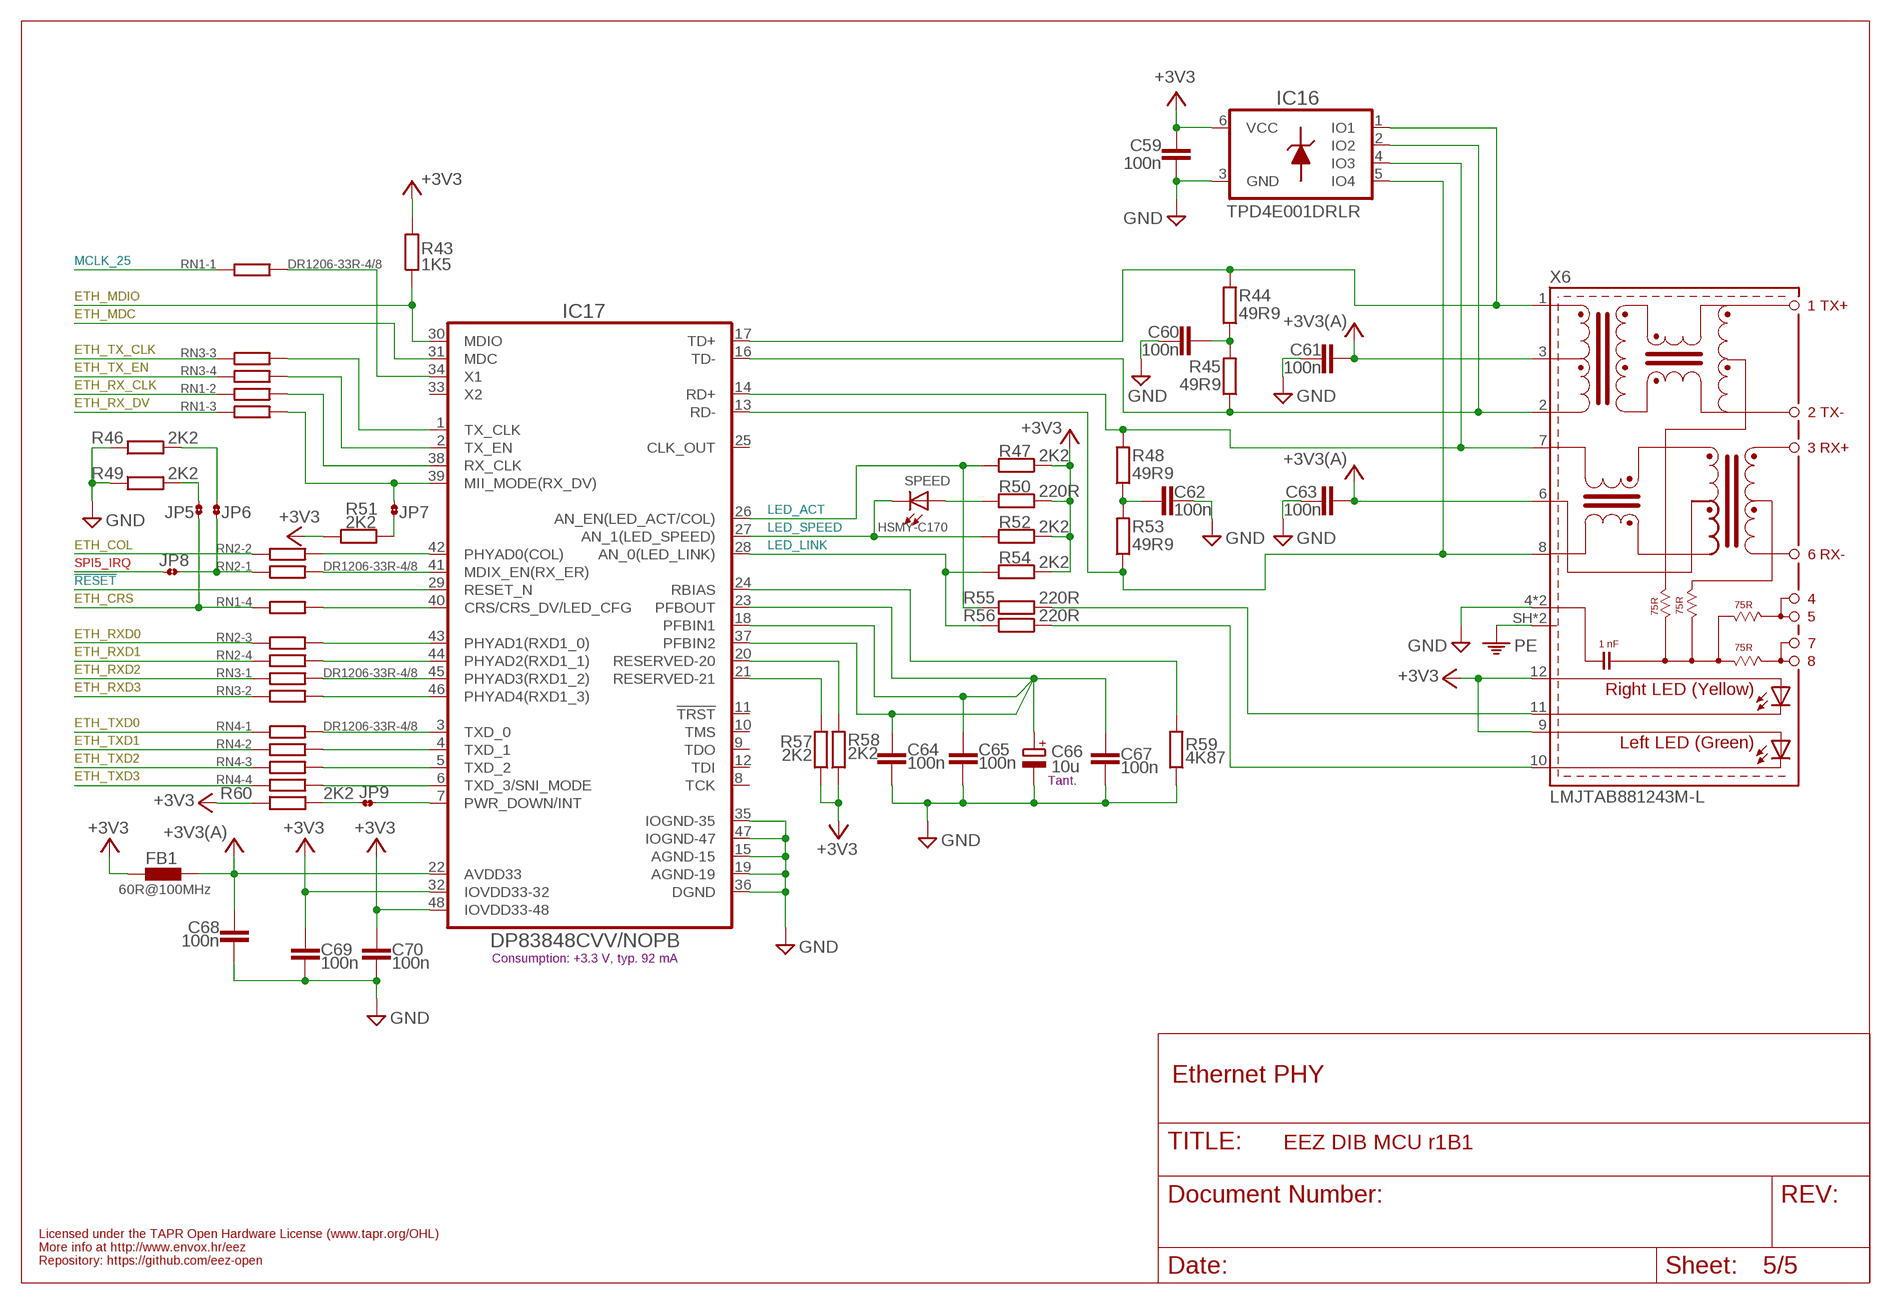
[diagram p4: schematic, sheet 5]

### Parts
C59  100n  C-EUC0603  [C0603]
C60  100n  C-EUC0603  [C0603]
C61  100n  C-EUC0603  [C0603]
C62  100n  C-EUC0603  [C0603]
C63  100n  C-EUC0603  [C0603]
C64  100n  C-EUC0603  [C0603]
C65  100n  C-EUC0603  [C0603]
C66  10u  ECAP1206  [EC1206]
C67  100n  C-EUC0603  [C0603]
C68  100n  C-EUC0603  [C0603]
C69  100n  C-EUC0603  [C0603]
C70  100n  C-EUC0603  [C0603]
FB1  60R@100MHz  FERRITE_BEAD0603  [BEAD0603]
IC16  TPD4E001DRLR  TPD4E001-DRL  [DRL6]
IC17  DP83848CVV/NOPB  [PT48]
JP5  JP2-CUT  [JP2-CUT]
JP6  JP2-CUT  [JP2-CUT]
JP7  JP2-CUT  [JP2-CUT]
JP8  JP2-CUT  [JP2-CUT]
JP9  JP2-NOCUT  [JP2-NOCUT]
R43  1K5  R-EU_R0805  [R0805]
R44  49R9  R-EU_R0805  [R0805]
R45  49R9  R-EU_R0805  [R0805]
R46  2K2  R-EU_R0805  [R0805]
R47  2K2  R-EU_R0805  [R0805]
R48  49R9  R-EU_R0805  [R0805]
R49  2K2  R-EU_R0805  [R0805]
R50  220R  R-EU_R0805  [R0805]
R51  2K2  R-EU_R0805  [R0805]
R52  2K2  R-EU_R0805  [R0805]
R53  49R9  R-EU_R0805  [R0805]
R54  2K2  R-EU_R0805  [R0805]
R55  220R  R-EU_R0805  [R0805]
R56  220R  R-EU_R0805  [R0805]
R57  2K2  R-EU_R0805  [R0805]
R58  2K2  R-EU_R0805  [R0805]
R59  4K87  R-EU_R0603  [R0603]
R60  2K2  R-EU_R0805  [R0805]
RN1  DR1206-33R-4/8  R_ARRAY4  [CAY16]
RN2  DR1206-33R-4/8  R_ARRAY4  [CAY16]
RN3  DR1206-33R-4/8  R_ARRAY4  [CAY16]
RN4  DR1206-33R-4/8  R_ARRAY4  [CAY16]
SPEED  HSMY-C170  LED0805  [LED_0805]
X6  LMJTAB881243M-L  RJ45-TRAFO-LED  [RJ45-TRAFO-LED]

### Nets
!RESET: IC17.29(RESET_N) ; also sheet 1,2,3,4
+3V3: C59.1 C69.1 C70.1 FB1.P$1 IC16.6(VCC) IC17.32(IOVDD33-32) IC17.48(IOVDD33-48) R43.2 R47.1 R50.1 R51.1 R52.1 R54.1 R57.1 R58.1 R60.1 X6.9(GREEN-A) X6.12(YELLOW_A) ; also sheet 1,2,3,4
+3V3(A): C61.2 C63.2 C68.1 FB1.P$2 IC17.22(AVDD33) X6.3(CT) X6.6(CR)
ETH_COL: RN2.2 ; also sheet 2
ETH_CRS: JP5.1 RN1.4 ; also sheet 2
ETH_MDC: IC17.31(MDC) ; also sheet 2
ETH_MDIO: IC17.30(MDIO) R43.1 ; also sheet 2
ETH_RX_CLK: RN1.2 ; also sheet 2
ETH_RX_DV: RN1.3 ; also sheet 2
ETH_RX_ER: JP6.1 JP8.1 RN2.1
ETH_RXD0: RN2.3 ; also sheet 2
ETH_RXD1: RN2.4 ; also sheet 2
ETH_RXD2: RN3.1 ; also sheet 2
ETH_RXD3: RN3.2 ; also sheet 2
ETH_TX_CLK: RN3.3 ; also sheet 2
ETH_TX_EN: RN3.4 ; also sheet 2
ETH_TXD0: RN4.1 ; also sheet 2
ETH_TXD1: RN4.2 ; also sheet 2
ETH_TXD2: RN4.3 ; also sheet 2
ETH_TXD3: RN4.4 ; also sheet 2
GND [gnd]: C59.2 C60.2 C61.1 C62.2 C63.1 C64.2 C65.2 C66.- C67.2 C68.2 C69.2 C70.2 IC16.3(GND) IC17.15(AGND-15) IC17.19(AGND-19) IC17.35(IOGND-35) IC17.36(DGND) IC17.47(IOGND-47) R46.1 R49.1 R59.1 X6.4(GND) X6.5(GND) ; also sheet 1,2,3,4
LED_ACT: IC17.26(AN_EN(LED_ACT/COL)) R47.2 R55.2
LED_LINK: IC17.28(AN_0(LED_LINK)) R54.2 R56.2
LED_SPEED: IC17.27(AN_1(LED_SPEED)) R52.2 SPEED.C
MCLK_25: RN1.1 ; also sheet 2
N$1: IC17.1(TX_CLK) RN3.6
N$3: C60.1 R44.1 R45.2
N$8: R55.1 X6.11(YELLOW-C)
N$9: R56.1 X6.10(GREEN-C)
N$10: IC17.2(TX_EN) RN3.5
N$11: IC17.39(MII_MODE(RX_DV)) JP7.2 RN1.6
N$12: IC17.38(RX_CLK) RN1.7
N$15: IC17.3(TXD_0) RN4.8
N$17: IC17.4(TXD_1) RN4.7
N$21: IC17.5(TXD_2) RN4.6
N$22: IC17.34(X1) RN1.8
N$23: JP7.1 R51.2
N$25: JP5.2 R49.2
N$26: JP6.2 R46.2
N$27: IC17.7(PWR_DOWN/INT) JP9.2
N$28: JP9.1 R60.2
N$29: IC17.6(TXD_3/SNI_MODE) RN4.5
N$31: IC17.46(PHYAD4(RXD1_3)) RN3.7
N$32: IC17.45(PHYAD3(RXD1_2)) RN3.8
N$33: IC17.42(PHYAD0(COL)) RN2.7
N$34: IC17.44(PHYAD2(RXD1_1)) RN2.5
N$35: IC17.43(PHYAD1(RXD1_0)) RN2.6
N$36: IC17.41(MDIX_EN(RX_ER)) RN2.8
N$37: IC17.40(CRS/CRS_DV/LED_CFG) RN1.5
N$97: IC17.24(RBIAS) R59.2
N$98: IC17.21(RESERVED-21) R57.2
N$99: IC17.20(RESERVED-20) R58.2
N$101: R50.2 SPEED.A
N$102: C62.1 R48.1 R53.2
PE: X6.SH X6.SH2(SH) ; also sheet 1,4
PFBOUT: C64.1 C65.1 C66.+ C67.1 IC17.18(PFBIN1) IC17.23(PFBOUT) IC17.37(PFBIN2)
RD+: IC16.4(IO3) IC17.14(RD+) R48.2 X6.7(RD+)
RD-: IC16.5(IO4) IC17.13(RD-) R53.1 X6.8(RD-)
SPI5_IRQ: JP8.2 ; also sheet 1,2
TD+: IC16.1(IO1) IC17.17(TD+) R44.2 X6.1(TD+)
TD-: IC16.2(IO2) IC17.16(TD-) R45.1 X6.2(TD-)
Unconnected: IC17.8(TCK) IC17.9(TDO) IC17.10(TMS) IC17.11(!TRST) IC17.12(TDI) IC17.25(CLK_OUT) IC17.33(X2)

### Notes on the sheet
- Tant.
- Consumption: +3.3 V, typ. 92 mA
- Ethernet PHY
- Licensed under the TAPR Open Hardware License (www.tapr.org/OHL)
- More info at http://www.envox.hr/eez
- Repository: https://github.com/eez-open

## Library data of the parts
B1 = EEZ_Lib1:CELL_BATTERY: HARWIN Battery holder for coin cell 20mm Farnell: 2115304
C1-C9 C11 C13-C18 C20-C46 C48-C65 C67-C70 = rcl:C-EU: CAPACITOR, European symbol
C10 C12 C19 C47 C66 = EEZ_Lib1:ECAP
D1 = MyLib6:DIODE
D2 = EEZ_Lib1:SCHOTTKY
F1 F2 = EEZ_Lib1:FUSE_RESETTABLE2
FB1 L1 = EEZ_Lib1:FERRITE_BEAD: FAIR-RITE - 2506033007Y3 - FERRITE BEAD, 0.04OHM, 3A, 0603 Farnell: 2112873
FM1 FM2 = EEZ_Lib1:FIDUCIAL: Fiducial mark for pick and place automation
IC1 IC6 IC7 IC12 IC14 IC16 = EEZ_Lib1:TPD4E001: Low-Capacitance 4-Channel ESD-Protection for High-Speed Data Interfaces
IC2 = EEZ_Lib1:SN74LVC2G34: Dual Buffer Gate
IC3 = EEZ_Lib1:BTS3408G: Smart Dual Low-side Power Switch
IC4 = EEZ_DIB:STM32F769IXT; COPYRIGHT: Copyright C 2016 Accelerated Designs. All rights reserved; MANUFACTURER_PART_NUMBER: stm32f769ixt; VENDOR: STMicroelectronics
IC5 = v-reg:LD117A?*: Low drop fixed and adjustable positive voltage regulators 1 A Source: http://www.st.com/stonline/products/literature/ds/7194/ld1117axx.pdf
IC8 = EEZ_Lib1:IS42S16400: 1 MBits x 16 Bits x 4 Banks (64-Mbit) Synchronous Dynamic RAM
IC9 = EEZ_DIB:BR24GXXX: I2C BUS EEPROM (2-Wire)
IC10 = EEZ_Lib1:TPS2051B: Current-Limited, Power-Distribution Switch (pos. enable input)
IC11 = EEZ_Lib1:TPS61169DCKR: 38-V High Current-Boost WLED Driver with PWM Control; MANUFACTURER: Texas Instruments; PARTNUMBER: TPS61169DCKR; REFDES: RefDes; TYPE: TYPE; VALUE: Value
IC13 = EEZ_Lib1:TPA6205: 1.25-W Mono Fully Differential Audio Power Amplifier
IC15 = EEZ_Lib1:AR1021-I/SS: AR1000 series resistive touch screen controller; I2C/SPI
IC17 = EEZ_Lib1:DP83848: DP83848C/I/VYB/YB PHYTER™ QFP Single Port 10/100 Mb/s Ethernet Physical Layer Transceiver
J1 = EEZ_Lib1:5033981892: SD Micro connector; push-push; SMT; gold plated
JP1 JP2 JP4 = EEZ_Lib1:JP3-CUT: 2-way SMT jumper with one position connected
JP3 JP9 = EEZ_Lib1:JP2-NOCUT
JP5-JP8 = EEZ_Lib1:JP2-CUT
L2 = EEZ_Lib1:DE0403: Ferrocore SMD power coil 4.0 x 4.5 mm
LCD1 = EEZ_Lib1:RFE430Y-AIW-DNS: 40-pin socket for TFT LCD display with touchscreen
Q1 = transistor:*-NPN-: NPN Transistror BF959 corrected 2008.03.06
R1-R60 = rcl:R-EU_: RESISTOR, European symbol
RN1-RN4 = EEZ_Lib1:R_ARRAY4: 1206 four resistor array
SP1 = EEZ_Lib1:LD-BZEL: SMD loudspeaker; 0.7W; 13x13x4mm; Sound level:88dB
SPEED TOUCH VBUS = EEZ_Lib1:LED
SW1 = EEZ_switches:ENCODER_SW
SW2 = EEZ_switches:BSF-315X: Tactile Switch, Side-operated, Projected Plunger Type
X1 = EEZ_connectors:ZL263-40DG: Socket; pin strips; female; PIN:40; angled 90°; 2.54mm; THT; 2x20
X2 = EEZ_connectors:IDC-16PIN: 16-pin IDC socket
X3 = EEZ_connectors:MC1,5/5-G-3,5: Pluggable Terminal Blocks 5-pin 3.5mm pitch Through Hole Header
X4 = EEZ_connectors:IDC-20PIN: 20-pin IDC socket
X5 = EEZ_Lib1:USB-B: USB 2.0 Type B Single port and Right Angle AMP Part Number: 292304-1 Farnell: 1076665 Mouser: 571-292304-1 Digikey: A31725-ND
X6 = EEZ_Lib1:RJ45-TRAFO-LED: AMPHENOL LMJTAB881243M-L Socket; RJ45; PIN:8; shielded, with LED and trafo; TME: LMJTAB881243M-L
Y1 = EEZ_Lib1:XTAL
ZD1 ZD2 = EEZ_Lib1:PSMAXX: Transient Voltage Suppressor, TVS, P4SMA Series, Unidirectional
ZD3 = EEZ_Lib1:ZENER-DIODE

## Net classes
0 default: width 0.152 mm, drill 0.3 mm, clearance 0.203 mm
1 diff: width 0.229 mm, drill 0.3 mm, clearance 0.203 mm
2 gnd: width 0.152 mm, drill 0.3 mm, clearance 0.203 mm